# Altium schematic sheet FRAM.SchDoc
size 420 x 297 mm; Scale: 1:1; DocumentType: Схема электрическая принципиальная; FirstReferrence: АБВГ.123456.001
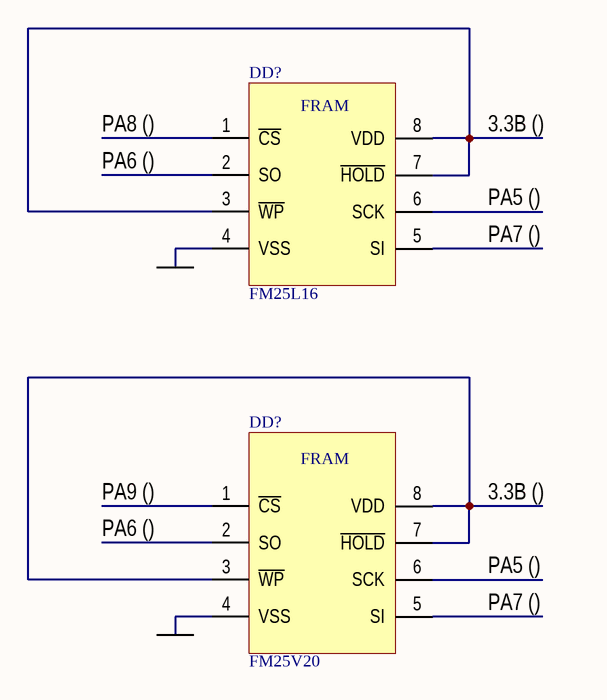
[diagram p0: FRAM.SchDoc]

## Parts
(Parts that share a designator on the sheet are numbered #1, #2 ... from top to bottom, then left to right.)
DD?#1  FM25L16  [SOIC127P600X175-8N]
DD?#2  FM25V20  [SOIC127P800X203-8N]

## Nets
NetDD?#1_3: DD?#1.3(~{WP}) DD?#1.7(~{HOLD}) DD?#1.8(VDD)
NetDD?#2_3: DD?#2.3(~{WP}) DD?#2.7(~{HOLD}) DD?#2.8(VDD)

Not connected (* = marked no-connect by the designer): DD?#1 1(~{CS}) 2(SO) 4(VSS) 5(SI) 6(SCK); DD?#2 1(~{CS}) 2(SO) 4(VSS) 5(SI) 6(SCK)

## Notes on the sheet
- PA6 ()
- PA8 ()
- 3.3В ()
- PA7 ()
- PA5 ()
- PA9 ()
- Подп. и дата
- Инв. № дубл.
- Взам. инв. №
- Инв. № подл.
- Изм.
- Лист
- № докум.
- Подп.
- Дата
- 2.106-A3
- Копировал
- Формат А3
- (in symbol FM25L16) FRAM
- (in symbol FM25V20) FRAM